# Altium schematic sheet Mems.SchDoc: Title
size A4; SchTemplateVer: V2.0; Author: Adam Mizerkiewicz; CompanyName: Adam Mizerkiewicz; DrawnBy: Adam Mizerkiewicz; Engineer: Adam Mizerkiewicz; Organization: Adam Mizerkiewicz; Address1: Sarnia 2/19; Address2: 61-058 Poznań; Revision: 0.0; SheetNumber: 5; SheetTotal: 18
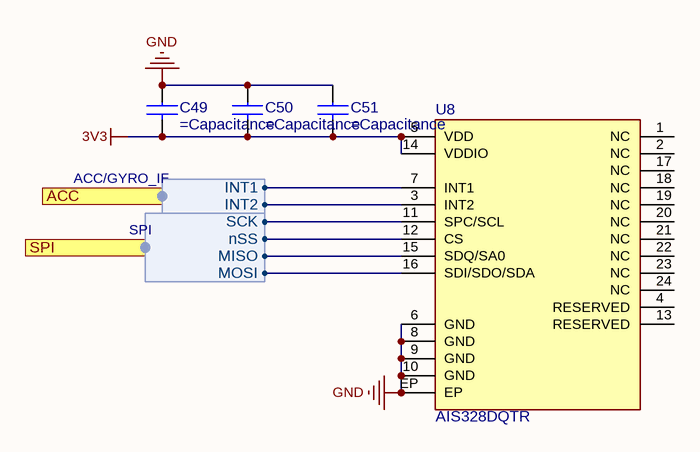
[diagram p0: Mems.SchDoc]

## Parts
C49  (no value)  [C0402]
C50  (no value)  [C0402]
C51  (no value)  [C0402]
U8  AIS328DQTR  [VQFN24]

## Ports
ACC (harness ACC/GYRO_IF), SPI (harness SPI)

## Harnesses
SPI: MISO, MOSI, SCK, nSS
ACC/GYRO_IF: INT1, INT2

## Nets
3V3: C49.2 C50.2 C51.2 U8.5(VDD) U8.14(VDDIO)
GND: C49.1 C50.1 C51.1 U8.6(GND) U8.8(GND) U8.9(GND) U8.10(GND) U8.EP
NetU8_3: U8.3(INT2) ; port ACC.INT2
NetU8_7: U8.7(INT1) ; port ACC.INT1
NetU8_11: U8.11(SPC/SCL) ; port SPI.SCK
NetU8_12: U8.12(CS) ; port SPI.nSS
NetU8_15: U8.15(SDQ/SA0) ; port SPI.MISO
NetU8_16: U8.16(SDI/SDO/SDA) ; port SPI.MOSI

Not connected (* = marked no-connect by the designer): U8 1(NC) 2(NC) 4(RESERVED) 13(RESERVED) 17(NC) 18(NC) 19(NC) 20(NC) 21(NC) 22(NC) 23(NC) 24(NC)

## Notes on the sheet
- Revision
  =Revision
- Sheet
  =SheetNumber / =SheetTotal

## Library data of the parts
C49 = CAP0402-1uF-25V: Multilayer Ceramic Capacitors MLCC - SMD/SMT 0402 1uF 25volts *Derate Voltage/Temp; Manufacturer: Murata; Manufacturer Part Number: GRM155C81E105KE11J; Manufacturer Lifecycle Status: IN PRODUCTION; Capacitance: 1µF; Value: 1µF; Dielectric: X6S; Tolerance: 10%; Voltage Rating: 25V; Supplier 1: DigiKey; Supplier Part Number 1: 490-GRM155C81E105KE11JCT-ND; Supplier: DigiKey; Supplier Part Number: 490-GRM155C81E105KE11JCT-ND; RoHS: Compliant; Category: Ceramic Capacitors; Stock: 78531; Pricing: 1=0,1, 10=0,043, 50=0,0294, 100=0,0253, 500=0,01832, 1000=0,01619, 2500=0,01394, 5000=0,01258 (USD); Case/Package: 0402; Case Code (Imperial): 0402; Case Code (Metric): 1005; Dielectric Material: Ceramic; Height: 500µm; Length: 1mm; Lifecycle Status: Production; Material: Ceramic; Max Operating Temperature: 105°C; Min Operating Temperature: -55°C; Mounting Technology: Surface Mount; Number of Terminals: 2; Packaging: Tape & Reel (TR); REACH SVHC: Yes; Termination: SMD/SMT; Thickness: 500µm; Voltage Rating (DC): 25V; Weight: 6.010099mg; Width: 500µm; ComponentLink1URL: https://datasheet.octopart.com:443/GRM155C81E105KE11J-Murata-datasheet-165579666.pdf?src-supplier=TME; ComponentLink1Description: https://datasheet.octopart.com:443/GRM155C81E105KE11J-Murata-datasheet-165579666.pdf?src-supplier=TME; ComponentLink2URL: https://datasheet.octopart.com:443/GRM155C81E105KE11J-Murata-datasheet-141266224.pdf?src-supplier=Ciiva; ComponentLink2Description: https://datasheet.octopart.com:443/GRM155C81E105KE11J-Murata-datasheet-141266224.pdf?src-supplier=Ciiva; ComponentLink3URL: https://datasheet.octopart.com:443/GRM155C81E105KE11J-Murata-datasheet-140688500.pdf?src-supplier=Ciiva; ComponentLink3Description: https://datasheet.octopart.com:443/GRM155C81E105KE11J-Murata-datasheet-140688500.pdf?src-supplier=Ciiva; ComponentLink4URL: https://datasheet.octopart.com:443/GRM155C81E105KE11J-Murata-datasheet-138740527.pdf?src-supplier=Ciiva; ComponentLink4Description: https://datasheet.octopart.com:443/GRM155C81E105KE11J-Murata-datasheet-138740527.pdf?src-supplier=Ciiva; ComponentLink5URL: https://datasheet.octopart.com:443/GRM155C81E105KE11J-Murata-datasheet-149522958.pdf?src-supplier=Farnell; ComponentLink5Description: https://datasheet.octopart.com:443/GRM155C81E105KE11J-Murata-datasheet-149522958.pdf?src-supplier=Farnell; ComponentLink6URL: https://datasheet.octopart.com/GRM155C81E105KE11J-Murata-datasheet-12515295.pdf; ComponentLink6Description: https://datasheet.octopart.com/GRM155C81E105KE11J-Murata-datasheet-12515295.pdf; ComponentLink7URL: https://datasheet.octopart.com/GRM155C81E105KE11J-Murata-datasheet-12510076.pdf; ComponentLink7Description: https://datasheet.octopart.com/GRM155C81E105KE11J-Murata-datasheet-12510076.pdf; ComponentLink8URL: https://datasheet.octopart.com/GRM155C81E105KE11J-Murata-datasheet-11978611.pdf; ComponentLink8Description: https://datasheet.octopart.com/GRM155C81E105KE11J-Murata-datasheet-11978611.pdf; ComponentLink9URL: https://datasheet.octopart.com/GRM155C81E105KE11J-Murata-datasheet-10025737.pdf; ComponentLink9Description: https://datasheet.octopart.com/GRM155C81E105KE11J-Murata-datasheet-10025737.pdf; ComponentLink10URL: https://datasheet.octopart.com/GRM155C81E105KE11J-Murata-datasheet-8819587.pdf; ComponentLink10Description: https://datasheet.octopart.com/GRM155C81E105KE11J-Murata-datasheet-8819587.pdf; ComponentLink11URL: https://datasheet.octopart.com/GRM155C81E105KE11J-Murata-datasheet-38882740.pdf; ComponentLink11Description: https://datasheet.octopart.com/GRM155C81E105KE11J-Murata-datasheet-38882740.pdf; ComponentLink12URL: http://sigma.octopart.com:80/reach_statement/Murata-company-16.pdf?src-supplier=Compliance+Statements; ComponentLink12Description: http://sigma.octopart.com:80/reach_statement/Murata-company-16.pdf?src-supplier=Compliance+Statements
C50 C51 = CAP0402-0.1uF-50V: CAP CER 0.1UF 50V X7R 0402; Manufacturer: Walsin Technologies; Manufacturer Part Number: 0402B104K500CT; Capacitance: 100nF; Material: 4241ConductorMaterial; Value: 100nF; Tolerance: 10%; Dielectric: 1511DielectricType; Supplier: Digikey; Supplier Part Number: 1292-1176-1-ND; RoHS: Yes; Category: Ceramic Capacitors; Stock: 109567; Pricing: 1=0,08, 10=0,005, 100=0,0032, 1000=0,0024 (USD); Mounting Technology: Surface Mount; Case/Package: 0402; Case Code (Imperial): 0402; Case Code (Metric): 1005; Min Operating Temperature: -55°C; Max Operating Temperature: 125°C; Packaging: Cut Tape; Voltage Rating: 50V; Series: -; Voltage Rating (DC): 50V; Height: 550um; RoHS Compliant: Yes; Lead Free: 5697LeadFree; ComponentLink1URL: http://datasheet.octopart.com/0402B104K500CT-Walsin-Technologies-datasheet-26371553.pdf?src-supplier=Arrow+Electronics; ComponentLink1Description: http://datasheet.octopart.com/0402B104K500CT-Walsin-Technologies-datasheet-26371553.pdf?src-supplier=Arrow+Electronics; ComponentLink2URL: http://datasheet.octopart.com/0402B104K500CT-Walsin-Technologies-datasheet-26371553.pdf?src-supplier=Verical; ComponentLink2Description: http://datasheet.octopart.com/0402B104K500CT-Walsin-Technologies-datasheet-26371553.pdf?src-supplier=Verical; ComponentLink3URL: http://www.passivecomponent.com/indexsea/0402B104K500CT-IE.pdf?src-supplier=Digikey; ComponentLink3Description: http://www.passivecomponent.com/indexsea/0402B104K500CT-IE.pdf?src-supplier=Digikey; ComponentLink4URL: http://datasheet.octopart.com/0402B104K500CT-Walsin-Technologies-datasheet-26371553.pdf?src-supplier=Rs; ComponentLink4Description: http://datasheet.octopart.com/0402B104K500CT-Walsin-Technologies-datasheet-26371553.pdf?src-supplier=Rs; ComponentLink5URL: https://datasheet.octopart.com/0402B104K500CT-Walsin-Technologies-datasheet-128065749.pdf?src-supplier=Future+Electronics; ComponentLink5Description: https://datasheet.octopart.com/0402B104K500CT-Walsin-Technologies-datasheet-128065749.pdf?src-supplier=Future+Electronics; ComponentLink6URL: http://datasheet.octopart.com/0402B104K500CT-Walsin-Technologies-datasheet-26371553.pdf?src-supplier=Farnell; ComponentLink6Description: http://datasheet.octopart.com/0402B104K500CT-Walsin-Technologies-datasheet-26371553.pdf?src-supplier=Farnell; ComponentLink7URL: http://datasheet.octopart.com/0402B104K500CT-Walsin-Technologies-datasheet-26371553.pdf?src-supplier=Newark; ComponentLink7Description: http://datasheet.octopart.com/0402B104K500CT-Walsin-Technologies-datasheet-26371553.pdf?src-supplier=Newark; ComponentLink8URL: http://datasheet.octopart.com/0402B104K500CT-Walsin-Technologies-datasheet-26371553.pdf?src-supplier=Mouser; ComponentLink8Description: http://datasheet.octopart.com/0402B104K500CT-Walsin-Technologies-datasheet-26371553.pdf?src-supplier=Mouser; ComponentLink9URL: http://datasheet.octopart.com/0402B104K500CT-Walsin-Technologies-datasheet-26371553.pdf?src-supplier=Digikey; ComponentLink9Description: http://datasheet.octopart.com/0402B104K500CT-Walsin-Technologies-datasheet-26371553.pdf?src-supplier=Digikey; ComponentLink10URL: https://datasheet.octopart.com/0402B104K500CT-Walsin-Technologies-datasheet-62066062.pdf?src-supplier=TME; ComponentLink10Description: https://datasheet.octopart.com/0402B104K500CT-Walsin-Technologies-datasheet-62066062.pdf?src-supplier=TME; ComponentLink11URL: http://datasheet.octopart.com/0402B104K500CT-Walsin-Technologies-datasheet-26371553.pdf?src-supplier=Freelance+Electronics; ComponentLink11Description: http://datasheet.octopart.com/0402B104K500CT-Walsin-Technologies-datasheet-26371553.pdf?src-supplier=Freelance+Electronics; ComponentLink12URL: http://datasheet.octopart.com/0402B104K500CT-Walsin-Technologies-datasheet-26371553.pdf?src-supplier=Component+Sense; ComponentLink12Description: http://datasheet.octopart.com/0402B104K500CT-Walsin-Technologies-datasheet-26371553.pdf?src-supplier=Component+Sense; ComponentLink13URL: http://datasheet.octopart.com/0402B104K500CT-Walsin-Technologies-datasheet-26371553.pdf?src-supplier=NAC+Semi; ComponentLink13Description: http://datasheet.octopart.com/0402B104K500CT-Walsin-Technologies-datasheet-26371553.pdf?src-supplier=NAC+Semi; ComponentLink14URL: https://datasheet.octopart.com/0402B104K500CT-Walsin-Technologies-datasheet-136037192.pdf?src-supplier=TECHDesign; ComponentLink14Description: https://datasheet.octopart.com/0402B104K500CT-Walsin-Technologies-datasheet-136037192.pdf?src-supplier=TECHDesign; Supplier 1: Digikey; Supplier Part Number 1: 1292-1176-1-ND
U8 = AIS328DQTR: High-performance ultra low-power 3-axis accelerometer | ACCELEROMETER 2-8G I2C/SPI 24QFN; Manufacturer: STMicroelectronics; Axis: X, Y, Z; Bandwidth: 500Hz; Max Supply Voltage: 3.6V; Min Supply Voltage: 2.4V; Nominal Supply Current: 450µA; Number of Circuits: 1; Operating Supply Voltage: 3.3V; Output Type: Digital; Supplier 1: DigiKey; Supplier Part Number 1: 497-13219-1-ND; Supplier: DigiKey; Supplier Part Number: 497-13219-1-ND; Manufacturer Part Number: AIS328DQTR; RoHS: Compliant; Category: Accelerometers; Stock: 11747; Pricing: 1=7,44, 5=6,716, 10=6,444, 25=6,1204, 50=5,8992, 100=5,6965, 500=5,508 (USD); Case/Package: QFN; China RoHS: Compliant; Contact Plating: Tin; Height - Seated (Max): 1.85mm; Lead Free: Lead Free; Length: 4mm; Lifecycle Status: Production; Max Operating Temperature: 105°C; Min Operating Temperature: -40°C; Mounting Technology: Surface Mount; Pins: 24; Number of Terminals: 24; Packaging: Tape & Reel; Radiation Hardening: No; REACH SVHC: Yes; Schedule B: 8542390000, 8542390000|8542390000|8542390000|8542390000|8542390000|8542390000|8542390000|8542390000|8542390000|8542390000|8542390000|8542390000|8542390000|8542390000|8542390000|8542390000|8542390000|8542390000|8542390000|8542390000|8542390000|8542390000|8542390000|85; Terminal Pitch: 500µm; Width: 4mm; ComponentLink1URL: https://datasheet.octopart.com:443/AIS328DQTR-STMicroelectronics-datasheet-12523467.pdf?src-supplier=Newark; ComponentLink1Description: https://datasheet.octopart.com:443/AIS328DQTR-STMicroelectronics-datasheet-12523467.pdf?src-supplier=Newark; ComponentLink2URL: https://datasheet.octopart.com:443/AIS328DQTR-STMicroelectronics-datasheet-10836675.pdf?src-supplier=Factory+Futures; ComponentLink2Description: https://datasheet.octopart.com:443/AIS328DQTR-STMicroelectronics-datasheet-10836675.pdf?src-supplier=Factory+Futures; ComponentLink3URL: https://datasheet.octopart.com:443/AIS328DQTR-STMicroelectronics-datasheet-141402747.pdf?src-supplier=element14+APAC; ComponentLink3Description: https://datasheet.octopart.com:443/AIS328DQTR-STMicroelectronics-datasheet-141402747.pdf?src-supplier=element14+APAC